# EAGLE design max7219_breakout (EAGLE 6.2)
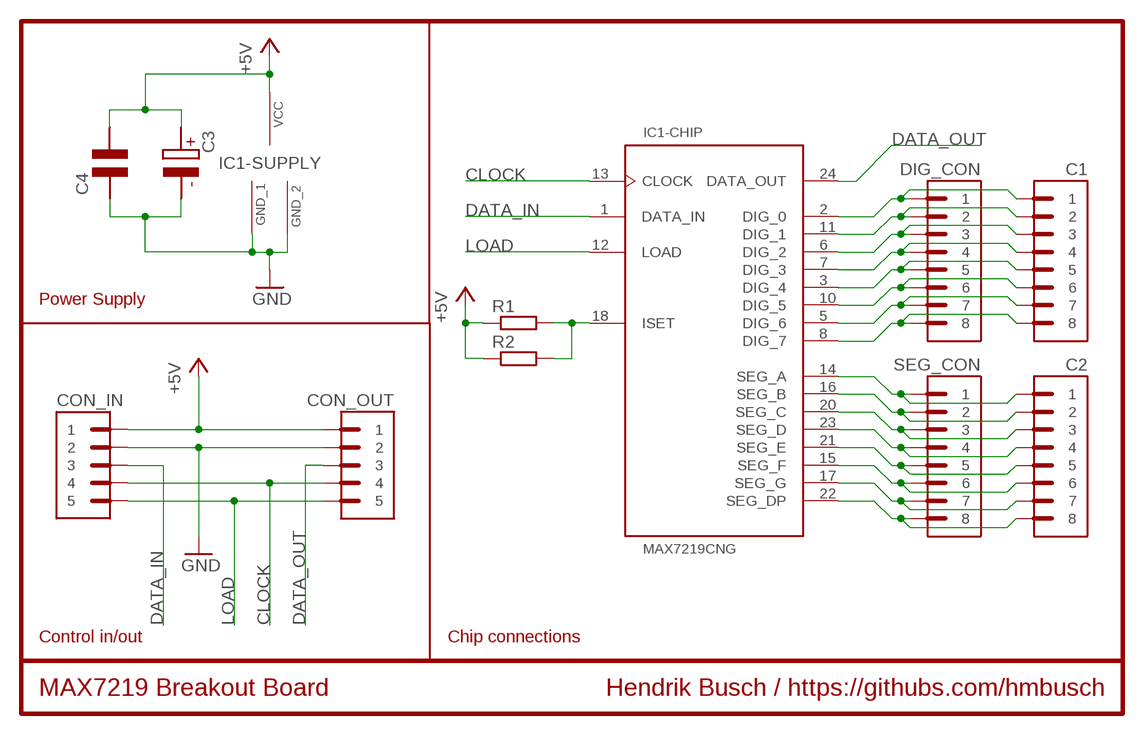
[diagram p0: schematic, sheet 1]

## Parts
C1  PIN_HEADER_8-SCREW-TERMINAL  [TERMINAL_BLOCK_8]
C2  PIN_HEADER_8-SCREW-TERMINAL  [TERMINAL_BLOCK_8]
C3  CAPACITOR_POLARIZED-5X5-2.0  [CAP_POL_5X5_2]
C4  CAPACITOR-CERAMIC-5MM  [CERAMIC_CAP_5MM]
CON_IN  PIN_HEADER_5-WIDE  [BREAKAWAY_STRAIGHT_5_WIDE]
CON_OUT  PIN_HEADER_5-WIDE  [BREAKAWAY_STRAIGHT_5_WIDE]
DIG_CON  PIN_HEADER_8-WIDE  [BREAKAWAY_STRAIGHT_8_WIDE]
IC1  MAX7219CNG  [DIP-24]
R1  RESISTOR-1/4W-12.7-AXIAL  [RESISTOR-1/4W-AXIAL]
R2  RESISTOR-1/4W-12.7-AXIAL  [RESISTOR-1/4W-AXIAL]
SEG_CON  PIN_HEADER_8-WIDE  [BREAKAWAY_STRAIGHT_8_WIDE]

## Nets
+5V: C3.A C4.P$2 CON_IN.1 CON_OUT.1 IC1.19(-SUPPLY:VCC) R1.P$1 R2.P$1
CLOCK: CON_IN.4 CON_OUT.4 IC1.13(-CHIP:CLOCK)
DATA_IN: CON_IN.3 IC1.1(-CHIP:DATA_IN)
DATA_OUT: CON_OUT.3 IC1.24(-CHIP:DATA_OUT)
DIG_0: C1.P$1 DIG_CON.1 IC1.2(-CHIP:DIG_0)
DIG_1: C1.P$2 DIG_CON.2 IC1.11(-CHIP:DIG_1)
DIG_2: C1.P$3 DIG_CON.3 IC1.6(-CHIP:DIG_2)
DIG_3: C1.P$4 DIG_CON.4 IC1.7(-CHIP:DIG_3)
DIG_4: C1.P$5 DIG_CON.5 IC1.3(-CHIP:DIG_4)
DIG_5: C1.P$6 DIG_CON.6 IC1.10(-CHIP:DIG_5)
DIG_6: C1.P$7 DIG_CON.7 IC1.5(-CHIP:DIG_6)
DIG_7: C1.P$8 DIG_CON.8 IC1.8(-CHIP:DIG_7)
GND: C3.C C4.P$1 CON_IN.2 CON_OUT.2 IC1.4(-SUPPLY:GND_1) IC1.9(-SUPPLY:GND_2)
LOAD: CON_IN.5 CON_OUT.5 IC1.12(-CHIP:LOAD)
N$1: IC1.18(-CHIP:ISET) R1.P$2 R2.P$2
SEG_A: C2.P$1 IC1.14(-CHIP:SEG_A) SEG_CON.1
SEG_B: C2.P$2 IC1.16(-CHIP:SEG_B) SEG_CON.2
SEG_C: C2.P$3 IC1.20(-CHIP:SEG_C) SEG_CON.3
SEG_D: C2.P$4 IC1.23(-CHIP:SEG_D) SEG_CON.4
SEG_DP: C2.P$8 IC1.22(-CHIP:SEG_DP) SEG_CON.8
SEG_E: C2.P$5 IC1.21(-CHIP:SEG_E) SEG_CON.5
SEG_F: C2.P$6 IC1.15(-CHIP:SEG_F) SEG_CON.6
SEG_G: C2.P$7 IC1.17(-CHIP:SEG_G) SEG_CON.7

## Notes on the sheet
- Power Supply
- Control in/out | Chip connections
- MAX7219 Breakout Board | Hendrik Busch / https://githubs.com/hmbusch

## Library data of the parts
C1 C2 DIG_CON SEG_CON = icmi-connectors:PIN_HEADER_8
C3 = icmi-passive-parts:CAPACITOR_POLARIZED: Polarized capacitor, e.g. electrolytic capacitor
C4 = icmi-passive-parts:CAPACITOR: WIMA MKS-2 Metallized Film (PET) Capacitor
CON_IN CON_OUT = icmi-connectors:PIN_HEADER_5
IC1 = icmi-ics:MAX7219: MAX7219 - Serially Interfaced, 8-Digit LED Display Driver
R1 R2 = icmi-passive-parts:RESISTOR-1/4W

## Board
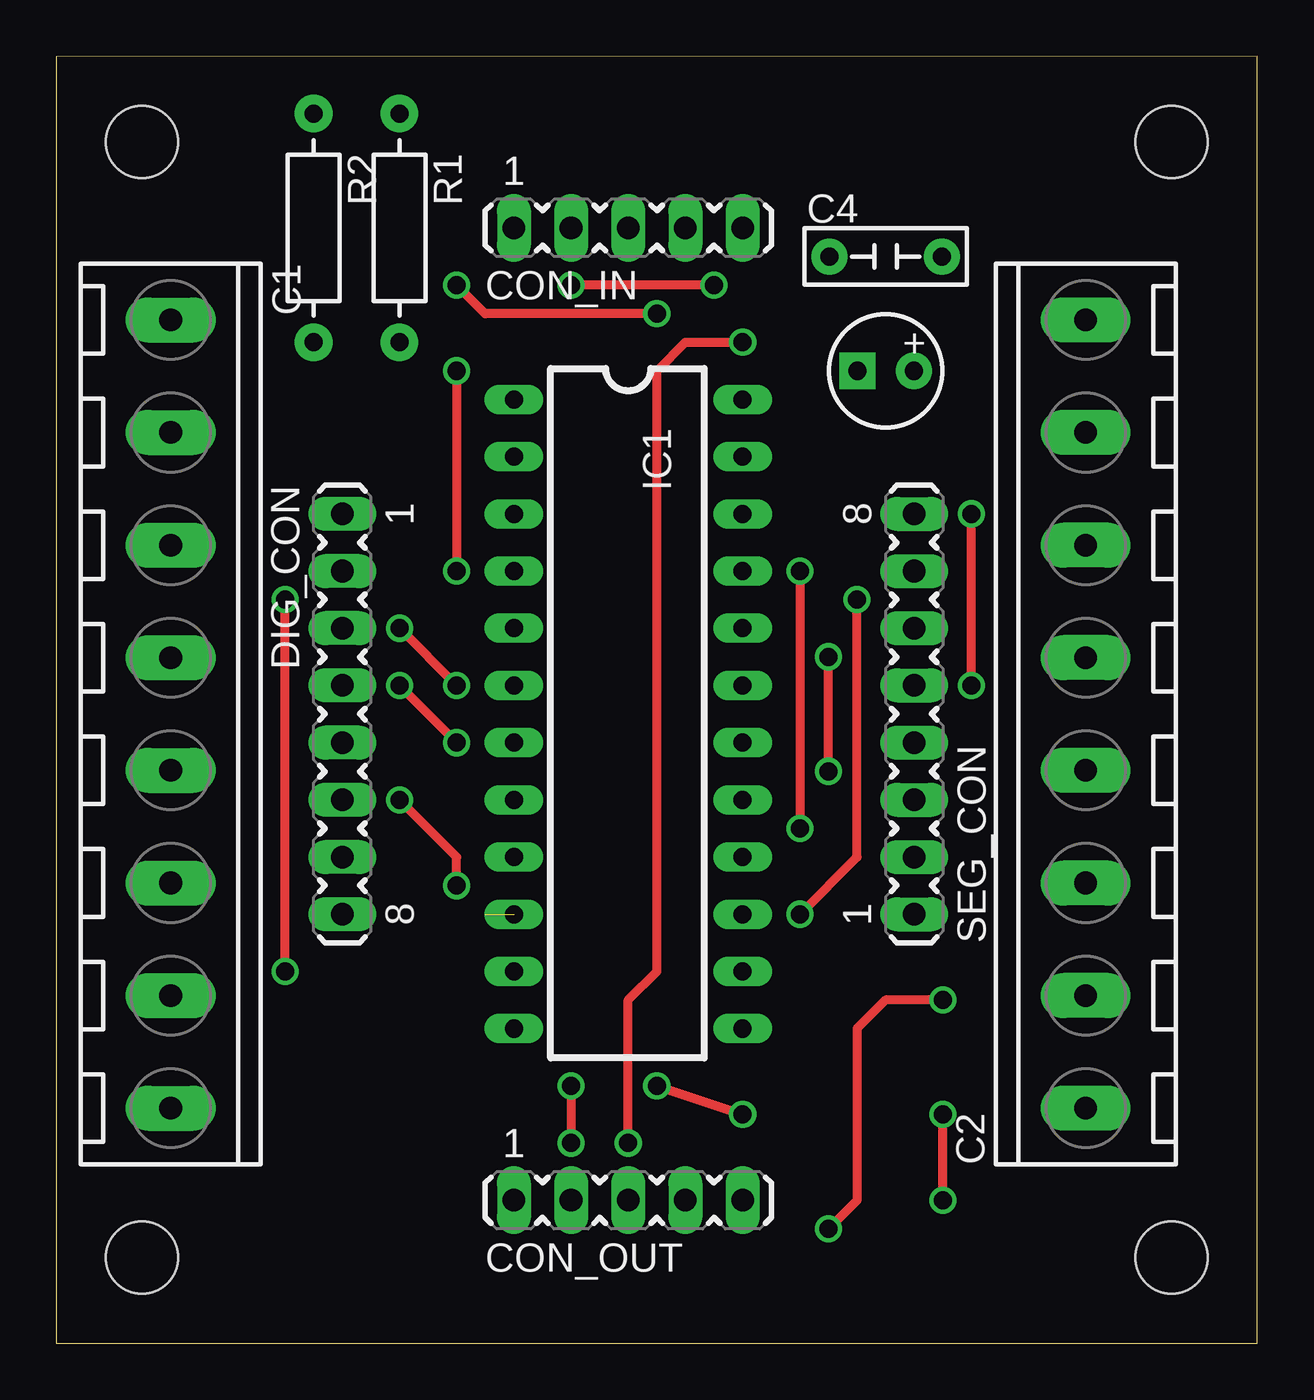
[diagram p1: board, top side]
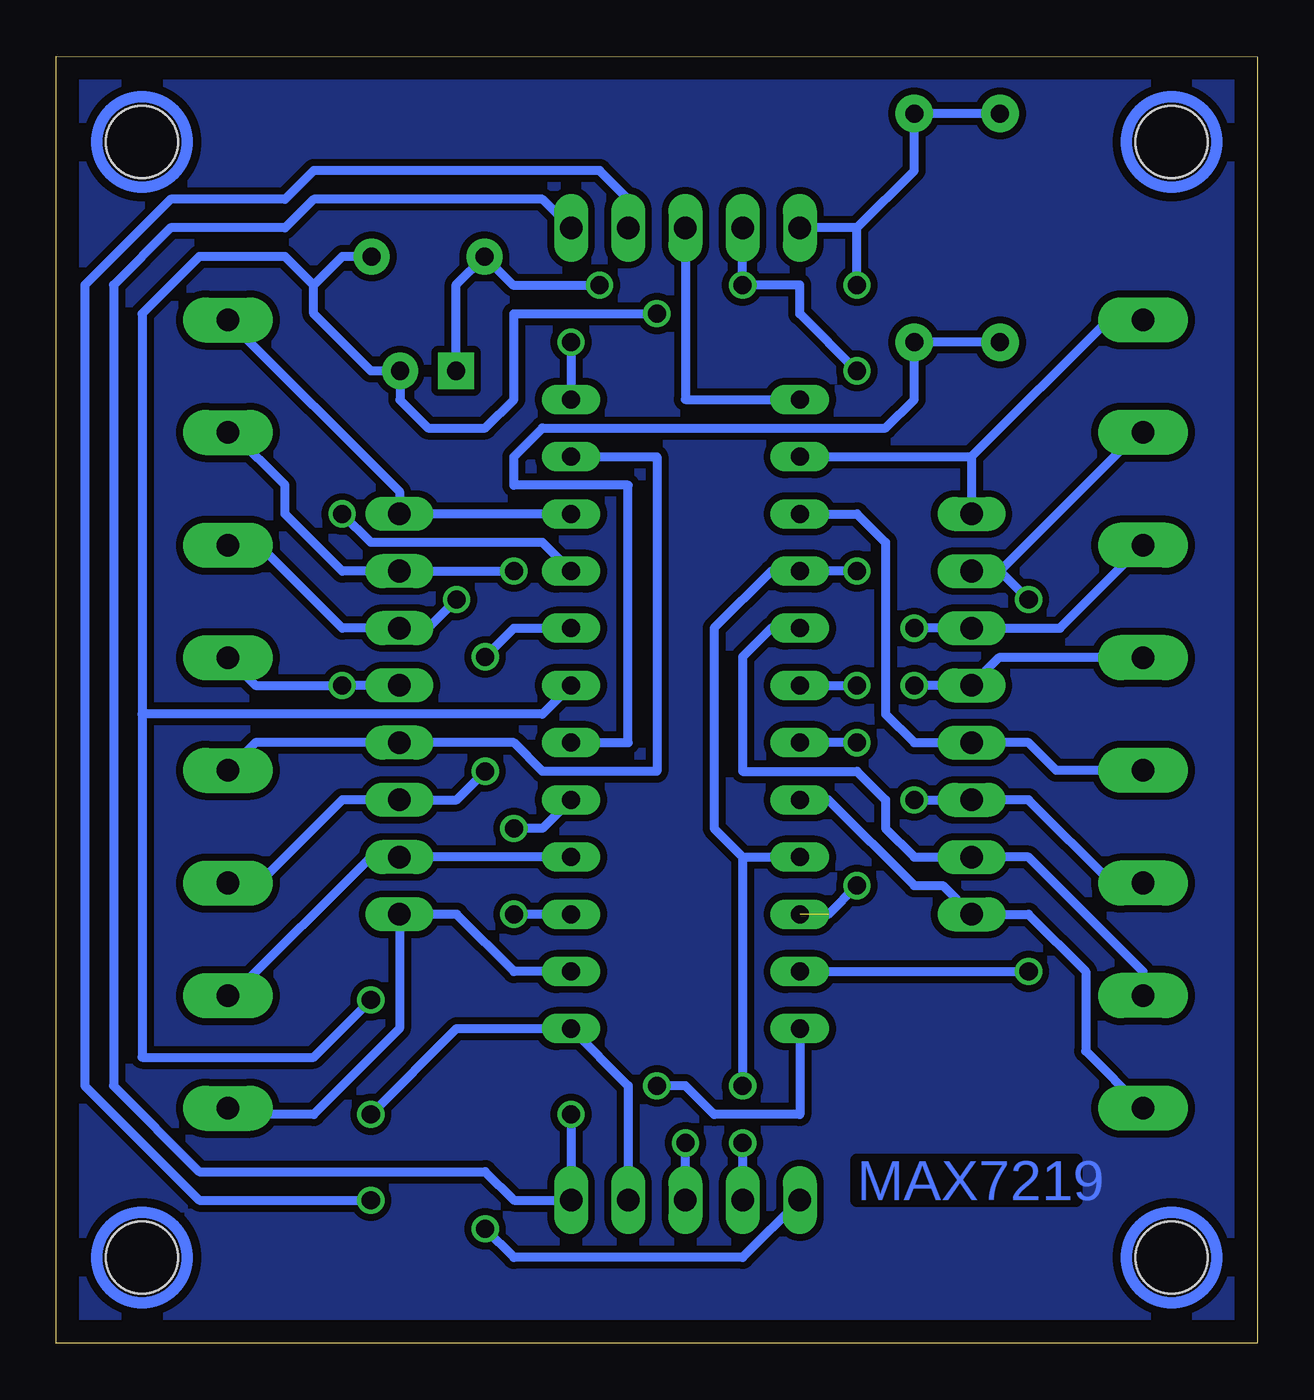
[diagram p2: board, bottom side, seen from below]

Size 53.34 x 57.15 mm. Coordinates in mm from the lower left corner, seen from the top.
Outline: 0,0 53.34,0 53.34,57.15 0,57.14 0,0
Copper layers (1*16): Top 0.035mm / dielectric 1.5mm / Bottom 0.035mm
Design rules: minimum track width 10mil, minimum drill 24mil, track to track 12mil, track to pad 12mil, pad to pad 12mil, via to via 12mil, smd to smd 8mil, copper to edge 40mil, drill to drill 8mil, minimum pad ring 10mil, minimum via ring 8mil, stop-mask expansion 4mil, vias tented up to drill 0mil, thermal gap 10mil
Holes 3.2 mm at 3.81,53.34 49.53,53.34 49.53,3.81 3.81,3.81

### Footprints (pad centres in the part's own frame; a part is rotated, then mirrored left to right if it is on the bottom)
TERMINAL_BLOCK_8 = drill 1 pad 2 long: P$1 -17.5,0; P$2 -12.5,0; P$3 -7.5,0; P$4 -2.5,0; P$5 2.5,0; P$6 7.5,0; P$7 12.5,0; P$8 17.5,0
CAP_POL_5X5_2 = drill 0.8 pad 1.6: A 1.25,0 | drill 0.8 pad 1.6 square: C -1.25,0
CERAMIC_CAP_5MM = drill 0.8 pad 1.6: P$1 -2.5,0; P$2 2.5,0
BREAKAWAY_STRAIGHT_5_WIDE = drill 1 long: 1 0,-5.08; 2 0,-2.54; 3 0,0; 4 0,2.54; 5 0,5.08
BREAKAWAY_STRAIGHT_8_WIDE = drill 1 long: 1 0,-8.89; 2 0,-6.35; 3 0,-3.81; 4 0,-1.27; 5 0,1.27; 6 0,3.81; 7 0,6.35; 8 0,8.89
DIP-24 = drill 0.8 long: 1 -11.43,-5.08; 2 -8.89,-5.08; 3 -6.35,-5.08; 4 -3.81,-5.08; 5 -1.27,-5.08; 6 1.27,-5.08; 7 3.81,-5.08; 8 6.35,-5.08; 9 8.89,-5.08; 10 11.43,-5.08; 11 13.97,-5.08; 12 16.51,-5.08; 13 16.51,5.08; 14 13.97,5.08; 15 11.43,5.08; 16 8.89,5.08; 17 6.35,5.08; 18 3.81,5.08; 19 1.27,5.08; 20 -1.27,5.08; 21 -3.81,5.08; 22 -6.35,5.08; 23 -8.89,5.08; 24 -11.43,5.08
RESISTOR-1/4W-AXIAL = drill 0.8 pad 1.676: P$1 -5.08,0; P$2 5.08,0

### Placement (x,y rotation side)
C1  5.08,27.94 270 top
C2  45.72,27.94 90 top
C3  36.83,43.18 0 top
C4  36.83,48.26 0 top
CON_IN  25.4,49.53 270 top
CON_OUT  25.4,6.35 270 top
DIG_CON  12.7,27.94 180 top
IC1  25.4,30.48 270 top
R1  15.24,49.53 270 top
R2  11.43,49.53 270 top
SEG_CON  38.1,27.94 0 top

### Tracks (layer width: path | path; a pad name or v marks a point on that pad's centre or on a via)
+5V  (via drill 0.8)
  Top 0.406: v26.67,45.72 19.05,45.72 v17.78,46.99 | v39.37,15.24 36.83,15.24 35.56,13.97 35.56,6.35 v34.29,5.08
  Bottom 0.406: IC1.19 31.75,27.94 49.53,27.94 | 41.91,46.99 41.91,45.72 39.37,43.18 C3.A 38.08,41.89 36.83,40.64 34.29,40.64 33.02,41.91 33.02,45.72 v26.67,45.72 | 41.91,46.99 43.18,48.26 46.99,48.26 49.53,45.72 49.53,27.94 | C4.P$2 40.64,48.26 41.91,46.99 | 17.78,49.53 CON_IN.1 | v17.78,46.99 17.78,49.53 | R2.P$1 R1.P$1 15.24,52.07 17.78,49.53 | 49.53,27.94 49.53,12.7 41.91,12.7 v39.37,15.24 | CON_OUT.1 22.86,3.81 33.02,3.81 v34.29,5.08
CLOCK  (via drill 0.8)
  Top 0.406: v39.37,6.35 v39.37,10.16
  Bottom 0.406: CON_OUT.4 27.94,11.43 IC1.13 35.56,13.97 v39.37,10.16 | CON_IN.4 27.94,50.8 29.21,52.07 41.91,52.07 43.18,50.8 48.26,50.8 52.07,46.99 52.07,11.43 46.99,6.35 v39.37,6.35
DATA_IN
  Bottom 0.406: CON_IN.3 25.4,41.91 IC1.1
DATA_OUT  (via drill 0.8)
  Top 0.406: v25.4,8.89 25.4,15.24 26.67,16.51 26.67,43.18 27.94,44.45 v30.48,44.45
  Bottom 0.406: CON_OUT.3 v25.4,8.89 | v30.48,44.45 IC1.24
DIG_0
  Bottom 0.406: C1.P$1 6.63,45.44 12.7,39.37 | 12.7,39.37 DIG_CON.1 | IC1.2 12.7,39.37
DIG_1  (via drill 0.8)
  Top 0.406: v10.16,16.51 v10.16,33.02
  Bottom 0.406: C1.P$2 5.28,40.44 11.43,34.29 | v10.16,33.02 11.43,34.29 | 11.43,34.29 DIG_CON.2 | IC1.11 v10.16,16.51
DIG_2  (via drill 0.8)
  Top 0.406: v15.24,31.75 v17.78,29.21
  Bottom 0.406: v15.24,31.75 DIG_CON.3 8.77,31.75 C1.P$3 | IC1.6 v17.78,29.21
DIG_3  (via drill 0.8)
  Top 0.406: v15.24,29.21 v17.78,26.67
  Bottom 0.406: C1.P$4 11.47,30.44 DIG_CON.4 v15.24,29.21 | v17.78,26.67 IC1.7
DIG_4
  Bottom 0.406: C1.P$5 8.93,25.44 10.16,26.67 DIG_CON.5 15.24,26.67 16.51,27.94 16.51,35.56 17.78,36.83 IC1.3
DIG_5  (via drill 0.8)  (1 unrouted)
  Top 0.406: v17.78,20.32 17.78,21.59 v15.24,24.13
  Bottom 0.406: C1.P$6 6.47,20.44 10.16,24.13 DIG_CON.6 v15.24,24.13 | 19.05,19.05 v17.78,20.32
DIG_6
  Bottom 0.406: C1.P$7 5.08,16.51 10.16,21.59 DIG_CON.7 15.24,21.59 16.51,22.86 16.51,24.13 17.78,25.4 22.86,25.4 22.86,30.48 21.59,31.75 IC1.5
DIG_7
  Bottom 0.406: C1.P$8 7.62,12.98 7.62,16.51 10.16,19.05 DIG_CON.8 13.97,20.32 15.24,20.32 19.05,24.13 IC1.8
GND  (via drill 0.8)
  Top 0.406: v17.78,43.18 v17.78,34.29 | v22.86,11.43 v22.86,8.89 | v29.21,46.99 v22.86,46.99
  Bottom 0.406: 22.86,21.59 24.13,22.86 24.13,31.75 21.59,34.29 IC1.4 v17.78,34.29 | 22.86,21.59 IC1.9 | C3.C 35.58,47.01 C4.P$1 33.06,46.99 v29.21,46.99 | 22.86,48.26 CON_IN.2 v22.86,46.99 20.32,46.99 20.32,45.72 v17.78,43.18 | 22.86,21.59 v22.86,11.43 | v22.86,8.89 CON_OUT.2
LOAD  (via drill 0.8)
  Top 0.406: v26.67,11.43 v30.48,10.16
  Bottom 0.406: IC1.12 20.32,10.16 24.13,10.16 25.4,11.43 v26.67,11.43 | v30.48,10.16 CON_OUT.5 33.02,6.35 34.29,7.62 46.99,7.62 50.8,11.43 50.8,46.99 48.26,49.53 43.18,49.53 41.91,50.8 31.75,50.8 CON_IN.5
N$1
  Bottom 0.406: R2.P$2 R1.P$2 15.24,41.91 16.51,40.64 31.75,40.64 33.02,39.37 33.02,38.1 27.94,38.1 27.94,26.67 IC1.18
N$2
  pour Bottom: 0,57.15 53.34,57.15 53.34,0 0,0
SEG_A
  Bottom 0.406: IC1.14 33.02,16.51 35.56,19.05 SEG_CON.1 38.1,13.97 41.91,10.16 45.44,10.16 C2.P$1
SEG_B
  Bottom 0.406: IC1.16 SEG_CON.2 39.37,21.59 45.52,15.44 C2.P$2
SEG_C  (via drill 0.8)
  Top 0.406: v34.29,25.4 v34.29,30.48
  Bottom 0.406: C2.P$3 44.33,20.44 40.64,24.13 SEG_CON.3 35.56,24.13 v34.29,25.4 | v34.29,30.48 33.02,31.75 IC1.20
SEG_D
  Bottom 0.406: C2.P$4 44.49,26.67 SEG_CON.4 33.02,26.67 31.75,25.4 26.67,25.4 26.67,39.37 IC1.23
SEG_DP
  Bottom 0.406: IC1.22 SEG_CON.8 38.1,37.82 C2.P$8
SEG_E  (via drill 0.8)
  Top 0.406: v40.64,29.21 v40.64,36.83
  Bottom 0.406: 36.83,29.21 SEG_CON.5 v40.64,29.21 44.49,29.21 C2.P$5 | IC1.21 31.75,35.56 39.37,35.56 v40.64,36.83
SEG_F  (via drill 0.8)
  Top 0.406: v35.56,33.02 35.56,21.59 v33.02,19.05
  Bottom 0.406: IC1.15 v33.02,19.05 | v35.56,33.02 36.83,31.75 SEG_CON.6 40.64,31.75 44.33,35.44 C2.P$6
SEG_G  (via drill 0.8)
  Top 0.406: v33.02,34.29 v33.02,22.86
  Bottom 0.406: v33.02,34.29 SEG_CON.7 40.64,34.29 43.18,36.83 43.18,38.1 45.52,40.44 C2.P$7 | IC1.17 31.75,22.86 v33.02,22.86
(copper drawn outside any net)
  shapes: Bottom circle x4

### Text on the board
Bottom: MAX7219